# EAGLE schematic familamp (EAGLE 7.6.0)
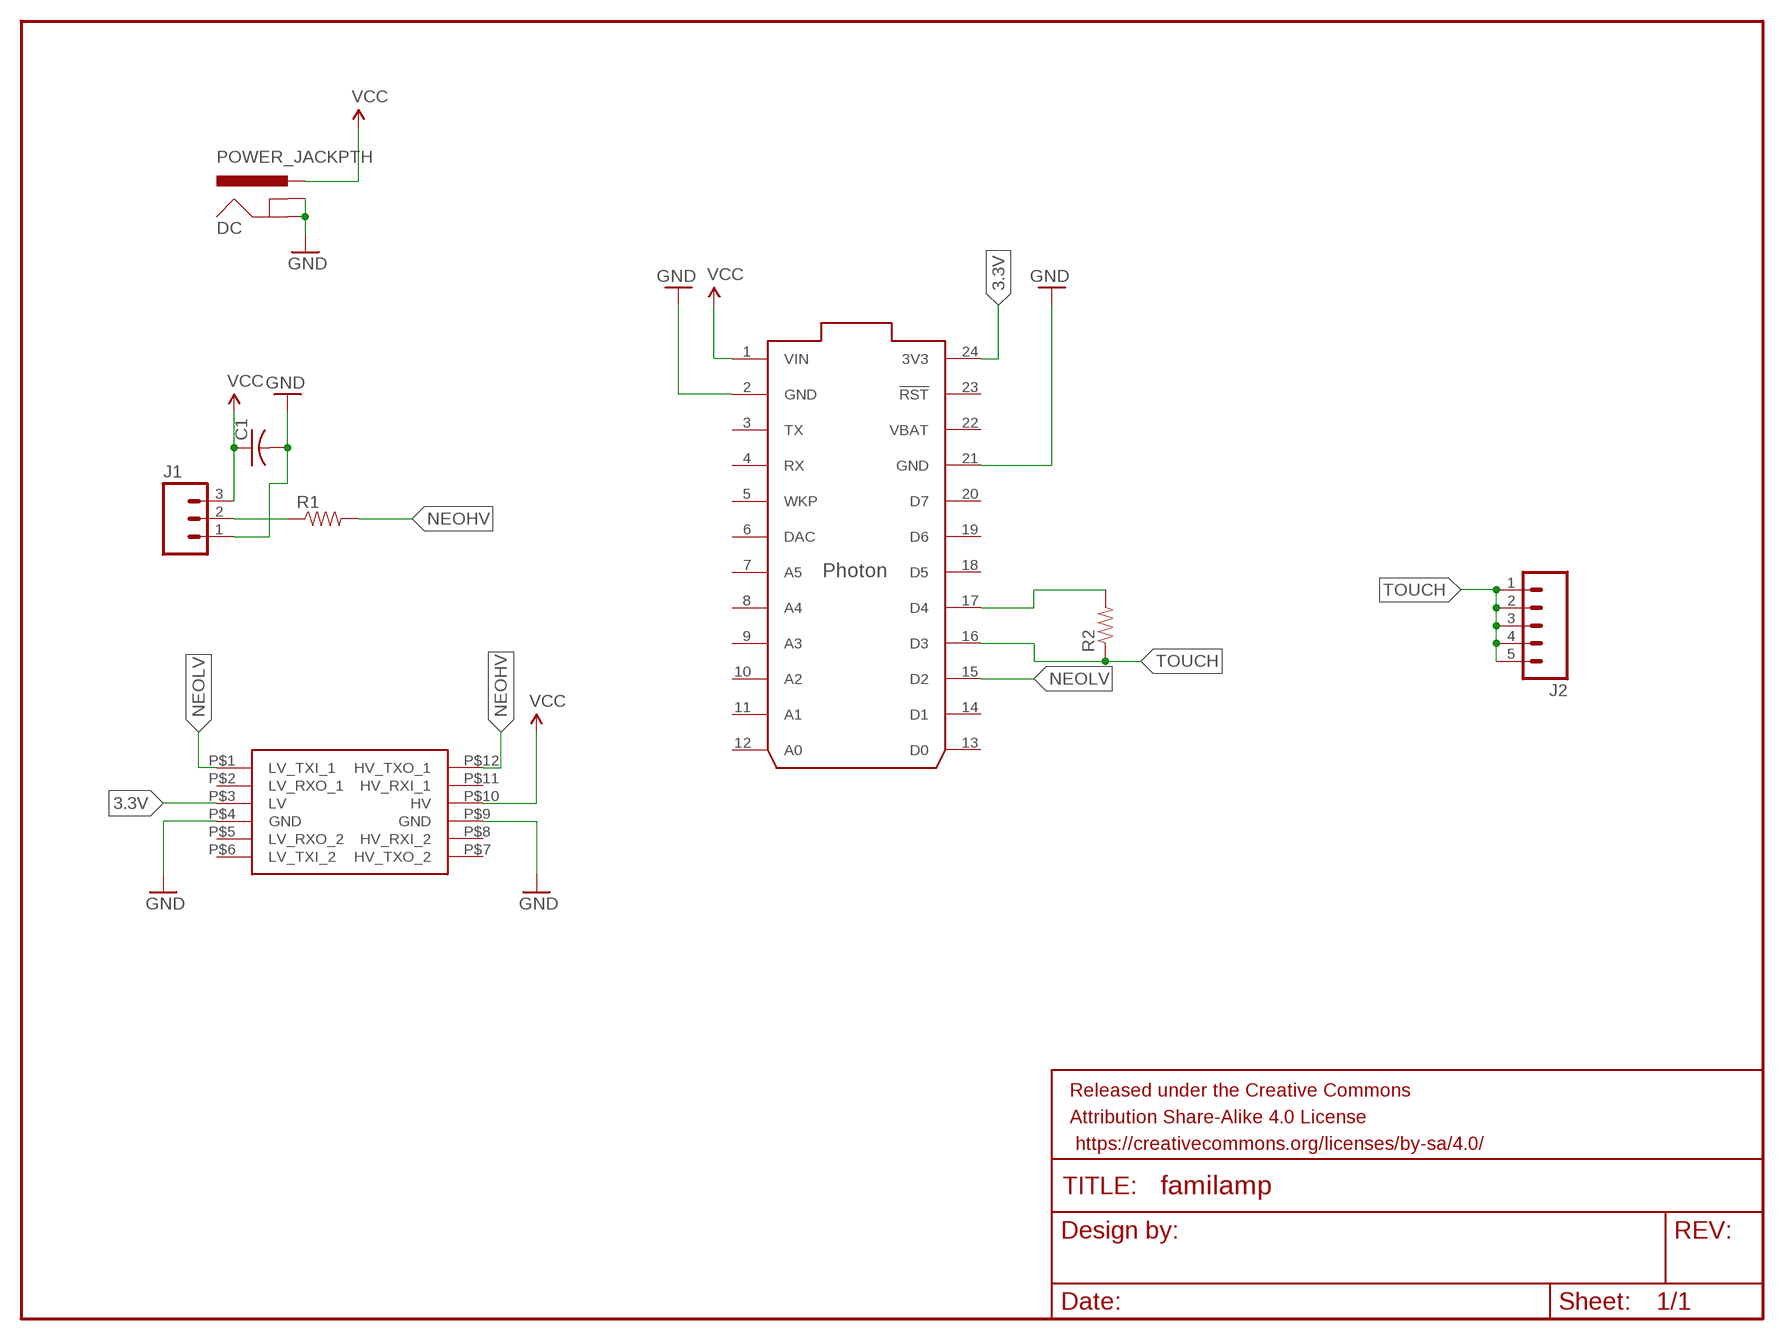
[diagram p0: schematic, sheet 1]

## Parts
C1  C-US050-035X075  [C050-035X075]
DC  POWER_JACKPTH  [POWER_JACK_PTH]
FRAME1  FRAME-LETTER  [CREATIVE_COMMONS]
J1  M03PTH  [1X03]
J2  M05PTH  [1X05]
PHOTON  PHOTON_WITH_HEADERS  [PHOTON]
R1  RESISTORPTH-1/4W  [AXIAL-0.4]
R2  RESISTORPTH-1/4W  [AXIAL-0.4]
U$2  LOGIC_LEVEL_CONVERTER  [LOGIC_LEVEL_CONVERTER]

## Nets
3.3V: PHOTON.24(3V3) U$2.P$3(LV)
GND: C1.2 DC.GND DC.GNDBREAK J1.1 PHOTON.2(GND) PHOTON.21(GND) U$2.P$4(GND) U$2.P$9(GND)
N$2: J1.2 R1.P$1
N$5: PHOTON.17(D4) R2.P$2
NEOHV: R1.P$2 U$2.P$12(HV_TXO_1)
NEOLV: PHOTON.15(D2) U$2.P$1(LV_TXI_1)
TOUCH: J2.1 J2.2 J2.3 J2.4 J2.5 PHOTON.16(D3) R2.P$1
VCC: C1.1 DC.PWR J1.3 PHOTON.1(VIN) U$2.P$10(HV)
Unconnected: PHOTON.3(TX) PHOTON.4(RX) PHOTON.5(WKP) PHOTON.6(DAC) PHOTON.7(A5) PHOTON.8(A4) PHOTON.9(A3) PHOTON.10(A2) PHOTON.11(A1) PHOTON.12(A0) PHOTON.13(D0) PHOTON.14(D1) PHOTON.18(D5) PHOTON.19(D6) PHOTON.20(D7) PHOTON.23(!RST) U$2.P$2(LV_RXO_1) U$2.P$5(LV_RXO_2) U$2.P$6(LV_TXI_2) U$2.P$7(HV_TXO_2) U$2.P$8(HV_RXI_2) U$2.P$11(HV_RXI_1)

## Power pins joined to a net without a drawn wire
VBAT: PHOTON.22(VBAT)

## Library data of the parts
C1 = rcl:C-US: CAPACITOR, American symbol
DC = SparkFun-Connectors:POWER_JACK: Power Jack This is the standard 5.5mm barrel jack for power. The PTH is the most common, proven, reliable, footprint. The Slot footprint only works if the mill layer is transmitted to the PCB fab house so be warned. Mating wall wart : TOL-00298 (and others); PROD_ID: CONN-08197
FRAME1 = SparkFun-Aesthetics:FRAME-LETTER: Schematic Frame Standard 8.5x11 US Letter frame
J1 = SparkFun-Connectors:M03: Header 3 Standard 3-pin 0.1" header. Use with straight break away headers (SKU : PRT-00116), right angle break away headers (PRT-00553), swiss pins (PRT-00743), machine pins (PRT-00117), and female headers (PRT-00115). Molex polarized connector foot print use with SKU : PRT-08232 with associated crimp pins and housings.
J2 = SparkFun-Connectors:M05: Header 5 Standard 5-pin 0.1" header. Use with straight break away headers (SKU : PRT-00116), right angle break away headers (PRT-00553), swiss pins (PRT-00743), machine pins (PRT-00117), and female headers (PRT-00115). Molex polarized connector foot print use with SKU : PRT-08230 with associated crimp pins and housings.
PHOTON = particle-photon:PHOTON
R1 = SparkFun-Passives:RESISTOR: Resistor Basic schematic elements and footprints for 0603, 1206, and PTH resistors.
R2 = SparkFun-Resistors:RESISTOR: Resistor Basic schematic elements and footprints for 0603, 1206, and PTH resistors.
U$2 = SparkFun-Boards:LOGIC_LEVEL_CONVERTER: Logic Level Converter (3.3v - 5v) https://www.sparkfun.com/products/8745